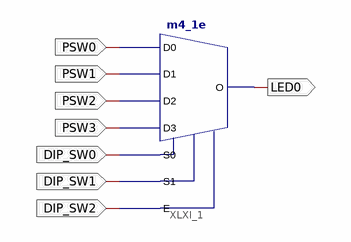
[diagram p0: schematic sheet 1]
// Xilinx ISE schematic lab4_mux2.sch (spartan3) as structural Verilog: 1 symbols, 8 ports
module lab4_mux2 (
  input  PSW0,
  input  PSW1,
  input  PSW2,
  input  PSW3,
  input  DIP_SW0,
  input  DIP_SW1,
  input  DIP_SW2,
  output LED0
);

  m4_1e XLXI_1 (.D0(PSW0), .D1(PSW1), .D2(PSW2), .D3(PSW3), .E(DIP_SW2), .S0(DIP_SW0), .S1(DIP_SW1), .O(LED0));
endmodule
